# Altium schematic sheet Audio Output.schdoc
size 267 x 196 mm
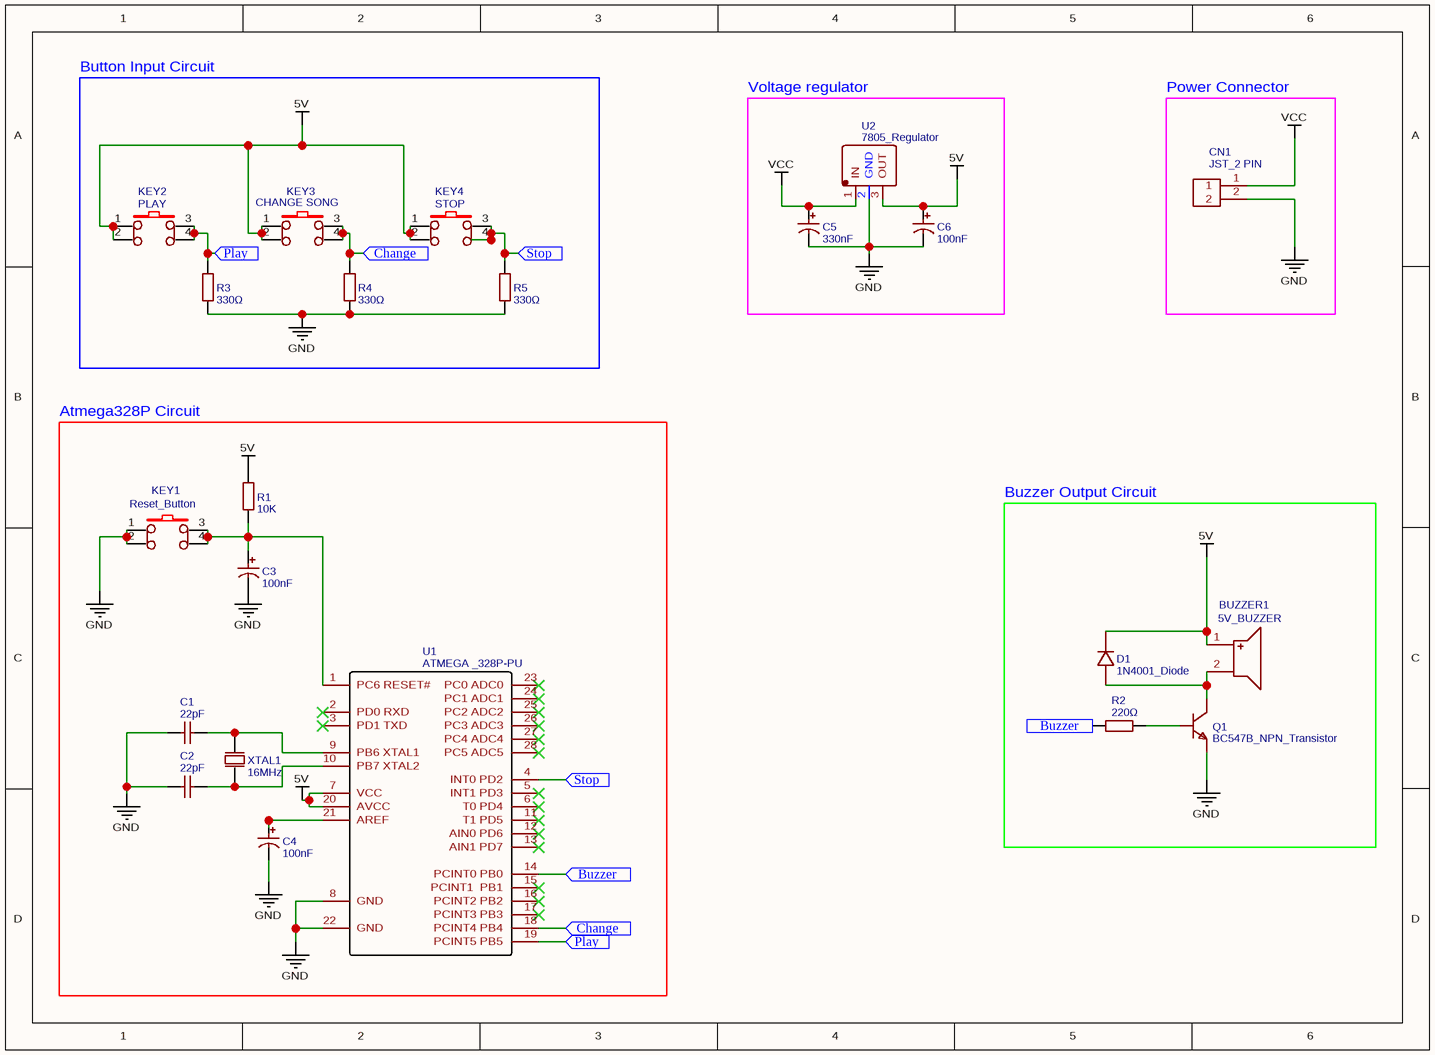
[diagram p0: Audio Output.schdoc]

## Parts
BUZZER1  5V_BUZZER  [DIP-BUZZER-12X6]
C1  22pF  [CAP-TH_L3.5-W3.0-P2.54-D0.8]
C2  22pF  [CAP-TH_L3.5-W3.0-P2.54-D0.8]
C3  100nF  [CAP-TH_BD5.0-P2.00-D0.8-FD]
C4  100nF  [CAP-TH_BD5.0-P2.00-D0.8-FD]
C5  330nF  [CAP-TH_BD5.0-P2.00-D0.8-FD]
C6  100nF  [CAP-TH_BD5.0-P2.00-D0.8-FD]
CN1  JST_2 PIN  [CONN-TH_XHB-2A]
D1  1N4001_Diode  [DO-41_BD2.4-L4.7-P8.70-D0.9-RD]
KEY1  Reset_Button  [KEY-TH_4P-L6.0-W6.0-P4.50]
KEY2  PLAY  [KEY-TH_4P-L6.0-W6.0-P4.50]
KEY3  CHANGE SONG  [KEY-TH_4P-L6.0-W6.0-P4.50]
KEY4  STOP  [KEY-TH_4P-L6.0-W6.0-P4.50]
Q1  BC547B_NPN_Transistor  [TO-92-3_L4.9-W3.7-P1.27-L]
R1  10K  [AXIAL-0.4]
R2  220Ω  [AXIAL-0.4]
R3  330Ω  [AXIAL-0.4]
R4  330Ω  [AXIAL-0.4]
R5  330Ω  [AXIAL-0.4]
U1  ATMEGA _328P-PU  [DIP-28_L34.6-W7.3-P2.54-LS10.2-BL]
U2  7805_Regulator  [TO-220-3_L10.0-W4.5-P2.54-L]
XTAL1  16MHz  [16MHZ_OSC [PCB]]

## Blocks framed on the sheet
Button Input Circuit: KEY2-KEY4 R3-R5
Voltage regulator: C5 C6 U2
Power Connector: CN1
Atmega328P Circuit: C1-C4 KEY1 R1 U1 XTAL1
Buzzer Output Circuit: BUZZER1 D1 Q1 R2

## Ports
Buzzer (in), Change (in), Play (in), Stop (in)

## Nets
5V: BUZZER1.1 C6.1 D1.1(C) KEY2.1 KEY2.2 KEY3.1 KEY3.2 KEY4.1 KEY4.2 R1.2 U1.7(VCC) U1.20(AVCC) U2.3(OUT)
GND: C1.1 C2.1 C3.2 C4.2 C5.2 C6.2 CN1.2 KEY1.1 KEY1.2 Q1.3(E) R3.1 R4.1 R5.1 U1.8(GND) U1.22(GND) U2.2(GND)
VCC: C5.1 CN1.1 U2.1(IN)
Buzzer: R2.1 U1.14(PCINT0_PB0) ; port Buzzer
Change: KEY3.3 KEY3.4 R4.2 U1.18(PCINT4_PB4) ; port Change
Play: KEY2.3 KEY2.4 R3.2 U1.19(PCINT5_PB5) ; port Play
Stop: KEY4.3 KEY4.4 R5.2 U1.4(INT0_PD2) ; port Stop
NetBUZZER1_2: BUZZER1.2 D1.2(A) Q1.1(C)
NetC1_2: C1.2 U1.9(PB6_XTAL1) XTAL1.1(OSC1)
NetC2_2: C2.2 U1.10(PB7_XTAL2) XTAL1.2(OSC2)
NetC3_1: C3.1 KEY1.3 KEY1.4 R1.1 U1.1(PC6_RESET#)
NetC4_1: C4.1 U1.21(AREF)
NetQ1_2: Q1.2(B) R2.2

Not connected (* = marked no-connect by the designer): U1 2(PD0_RXD)* 3(PD1_TXD)* 5(INT1_PD3)* 6(T0_PD4)* 11(T1_PD5)* 12(AIN0_PD6)* 13(AIN1_PD7)* 15(PCINT1__PB1)* 16(PCINT2_PB2)* 17(PCINT3_PB3)* 23(PC0_ADC0)* 24(PC1_ADC1)* 25(PC2_ADC2)* 26(PC3_ADC3)* 27(PC4_ADC4)* 28(PC5_ADC5)*

## Library data of the parts
BUZZER1 = 5V_BUZZER: BOM_Manufacturer: HNDZ; BOM_Manufacturer Part: BUZZERHMB1206-03; Contributor: วริศรา เกรียงไกรวัฒน์ /ทิพพะ; BOM_Supplier: LCSC; BOM_Supplier Part: C96101; spicePre: B; spiceSymbolName: 5V_BUZZER
C1 C2 = 22pF: BOM_Manufacturer: ReliaPro; BOM_Manufacturer Part: 22pf/50V 10%; nameAlias: Capacitance; BOM_Supplier: LCSC; BOM_Supplier Part: C9316; spicePre: C; spiceSymbolName: 22pF
C3 C4 C6 = 100nF: BOM_Manufacturer: ValuePro; BOM_Manufacturer Part: 0.1UF 50V; nameAlias: Capacitance; BOM_Supplier: LCSC; BOM_Supplier Part: C28061; BOM_JLCPCB Part Class: Extended Part; spicePre: C; spiceSymbolName: 0.1uF
C5 = 330nF: BOM_Manufacturer: ValuePro; BOM_Manufacturer Part: 0.33uF 50V 5*11; nameAlias: Capacitance; BOM_Supplier: LCSC; BOM_Supplier Part: C45097; BOM_JLCPCB Part Class: Extended Part; spicePre: C; spiceSymbolName: 0.33uF
CN1 = JST_2 PIN: BOM_Manufacturer: BOOMELE; BOM_Manufacturer Part: XHB-2A Connector; BOM_Supplier: LCSC; image: //image.lceda.cn/szlcsc/C57981.jpg; BOM_Supplier Part: C57981; BOM_JLCPCB Part Class: Extended Part; spicePre: C; spiceSymbolName: JST_2 PIN
D1 = 1N4001_Diode: BOM_Manufacturer: Diodes Incorporated; BOM_Manufacturer Part: 1N4001-T; Contributor: LCSC; BOM_Supplier: LCSC; BOM_Supplier Part: C99656; BOM_JLCPCB Part Class: Extended Part; spicePre: D; spiceSymbolName: 1N4001_Diode
KEY1 = Reset_Button: BOM_Manufacturer: ReliaPro; BOM_Manufacturer Part: button6*6*8.5; BOM_Supplier Part: C59980; BOM_Supplier: LCSC; image: http://image.lceda.cn/szlcsc/C59980.jpg; spicePre: K; spiceSymbolName: Push_Button
KEY2 = PLAY: BOM_Manufacturer: ReliaPro; BOM_Manufacturer Part: button6*6*8.5; BOM_Supplier Part: C59980; BOM_Supplier: LCSC; image: http://image.lceda.cn/szlcsc/C59980.jpg; spicePre: K; spiceSymbolName: Push_Button
KEY3 = CHANGE SONG: BOM_Manufacturer: ReliaPro; BOM_Manufacturer Part: button6*6*8.5; BOM_Supplier Part: C59980; BOM_Supplier: LCSC; image: http://image.lceda.cn/szlcsc/C59980.jpg; spicePre: K; spiceSymbolName: Push_Button
KEY4 = STOP: BOM_Manufacturer: ReliaPro; BOM_Manufacturer Part: button6*6*8.5; BOM_Supplier Part: C59980; BOM_Supplier: LCSC; image: http://image.lceda.cn/szlcsc/C59980.jpg; spicePre: K; spiceSymbolName: Push_Button
Q1 = BC547B_NPN_Transistor: BOM_Manufacturer: LGE; BOM_Manufacturer Part: BC547B; Contributor: LCSC; BOM_Supplier: LCSC; BOM_Supplier Part: C713613; BOM_JLCPCB Part Class: Extended Part; spicePre: Q; spiceSymbolName: BC547B_NPN_Transistor
R1 = 10K: BOM_Manufacturer: UniOhm; BOM_Manufacturer Part: MFR0W4F2200A50; Power: 1/4W; Tolerance: ±1%; BOM_EasyEDA: E57439; Value: Value; BOM_Supplier Part: E57439; BOM_Supplier: EasyEDA; spicePre: R; spiceSymbolName: RESISTOR
R2 = 220Ω: BOM_Manufacturer: UniOhm; BOM_Manufacturer Part: MFR0W4F2200A50; Power: 1/4W; Tolerance: ±1%; BOM_EasyEDA: E57439; Value: Value; BOM_Supplier Part: E57439; BOM_Supplier: EasyEDA; spicePre: R; spiceSymbolName: RESISTOR
R3-R5 = 330Ω: BOM_Manufacturer: UniOhm; BOM_Manufacturer Part: MFR0W4F2200A50; Power: 1/4W; Tolerance: ±1%; BOM_EasyEDA: E57439; Value: Value; BOM_Supplier Part: E57439; BOM_Supplier: EasyEDA; spicePre: R; spiceSymbolName: RESISTOR
U1 = ATMEGA _328P-PU: BOM_Manufacturer: MICROCHIP; BOM_Manufacturer Part: ATMEGA328P-PU; sourceId: Oic6oiASL; Contributor: LCSC; timeStamp: 1451725987; BOM_Supplier: LCSC; image: //image.lceda.cn/szlcsc/C33901.jpg; BOM_Supplier Part: C33901; spicePre: U; spiceSymbolName: ATMEGA _328P-PU
U2 = 7805_Regulator: BOM_Manufacturer: Foshan Blue Rocket Elec; BOM_Manufacturer Part: 7805; Contributor: LCSC; BOM_Supplier: LCSC; BOM_Supplier Part: C305416; BOM_JLCPCB Part Class: Extended Part; spicePre: U; spiceSymbolName: 7805_Regulator
XTAL1 = 16MHz: BOM_Manufacturer: SHIVRAM; BOM_Manufacturer Part: 0SC-16MHz; nameAlias: Frequency; Contributor: Mantas Petrauskas; BOM_Supplier: SHIVRAM; BOM_Supplier Part: 0SC-16MHz; spicePre: X; spiceSymbolName: Crystal Oscillator